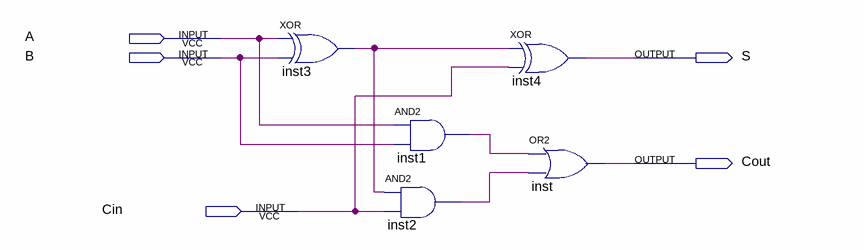
[diagram p0: schematic sheet]
// Quartus schematic fullAdder.bdf as structural Verilog: 5 symbols, 5 pins
module fullAdder (
  input  A,
  input  B,
  input  Cin,
  output S,
  output Cout
);

  wire inst1_out, inst2_out, inst3_out;

  xor inst3 (inst3_out, A, B);
  and inst1 (inst1_out, A, B);
  and inst2 (inst2_out, inst3_out, Cin);
  xor inst4 (S, inst3_out, Cin);
  or inst (Cout, inst1_out, inst2_out);
endmodule
